# Altium schematic sheet Module_1_CHA_CHB.SchDoc
size A
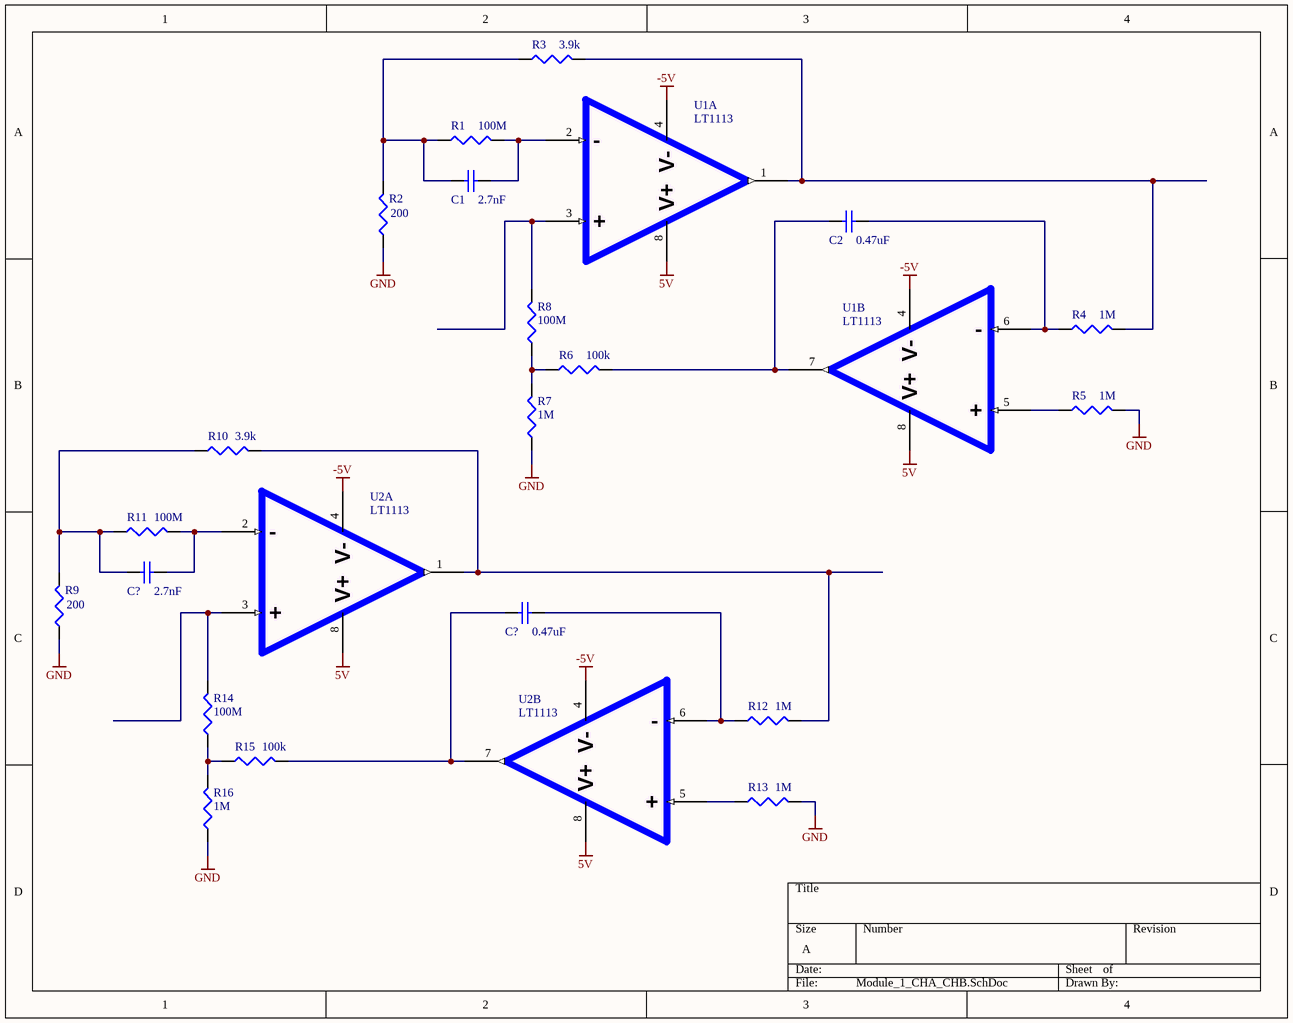
[diagram p0: Module_1_CHA_CHB.SchDoc]

## Parts
(Parts that share a designator on the sheet are numbered #1, #2 ... from top to bottom, then left to right.)
C1  value 2.7nF  [0603]  (hidden comment: Cap Semi)
C2  value 0.47uF  [0603]  (hidden comment: Cap Semi)
C?#1  value 2.7nF  [0603]  (hidden comment: Cap Semi)
C?#2  value 0.47uF  [0603]  (hidden comment: Cap Semi)
R1  value 100M  [J1-0603]  (hidden comment: Res3)
R2  value 200  [J1-0603]  (hidden comment: Res3)
R3  value 3.9k  [J1-0603]  (hidden comment: Res3)
R4  value 1M  [J1-0603]  (hidden comment: Res3)
R5  value 1M  [J1-0603]  (hidden comment: Res3)
R6  value 100k  [J1-0603]  (hidden comment: Res3)
R7  value 1M  [J1-0603]  (hidden comment: Res3)
R8  value 100M  [J1-0603]  (hidden comment: Res3)
R9  value 200  [J1-0603]  (hidden comment: Res3)
R10  value 3.9k  [J1-0603]  (hidden comment: Res3)
R11  value 100M  [J1-0603]  (hidden comment: Res3)
R12  value 1M  [J1-0603]  (hidden comment: Res3)
R13  value 1M  [J1-0603]  (hidden comment: Res3)
R14  value 100M  [J1-0603]  (hidden comment: Res3)
R15  value 100k  [J1-0603]  (hidden comment: Res3)
R16  value 1M  [J1-0603]  (hidden comment: Res3)
U1  LT1113  [SO8_L]  (parts A,B of 2)
U2  LT1113  [SO8_L]  (parts A,B of 2)

## Nets
5V: U1.8(V+) U2.8(V+)
-5V: U1.4(V-) U2.4(V-)
GND: R2.1 R5.2 R7.1 R9.1 R13.2 R16.1
NetC1_1: C1.1 R1.1 R2.2 R3.1
NetC1_2: C1.2 R1.2 U1.2(-)
NetC2_1: C2.1 R6.2 U1.7(OUTA)
NetC2_2: C2.2 R4.1 U1.6(-)
NetC?#1_1: C?#1.1 R9.2 R10.1 R11.1
NetC?#1_2: C?#1.2 R11.2 U2.2(-)
NetC?#2_1: C?#2.1 R15.2 U2.7(OUTA)
NetC?#2_2: C?#2.2 R12.1 U2.6(-)
NetR3_2: R3.2 R4.2 U1.1(OUTA)
NetR5_1: R5.1 U1.5(+)
NetR6_1: R6.1 R7.2 R8.1
NetR8_2: R8.2 U1.3(+)
NetR10_2: R10.2 R12.2 U2.1(OUTA)
NetR13_1: R13.1 U2.5(+)
NetR14_1: R14.1 R15.1 R16.2
NetR14_2: R14.2 U2.3(+)

## Library data of the parts
C1 C2 C?#1 C?#2 = Cap Semi: Capacitor (Semiconductor SIM Model); Published: 8-Jun-2000; LatestRevisionDate: 29-May-2009; LatestRevisionNote: IPC-7351 Footprint Added.; PackageReference: C1206; Publisher: Altium Limited; PackageDescription: Chip Capacitor
R1-R16 = Res3: Resistor; Published: 8-Jun-2000; LatestRevisionDate: 29-May-2009; LatestRevisionNote: IPC-7351 Footprint Added.; PackageReference: J1-0603; Publisher: Altium Limited; PackageDescription: Chip Resistor
U1 U2 = LT1113: LT1113 Opamp